# Altium schematic sheet TINY1616.SchDoc
size A4; SheetNumber: 1; SheetTotal: 1
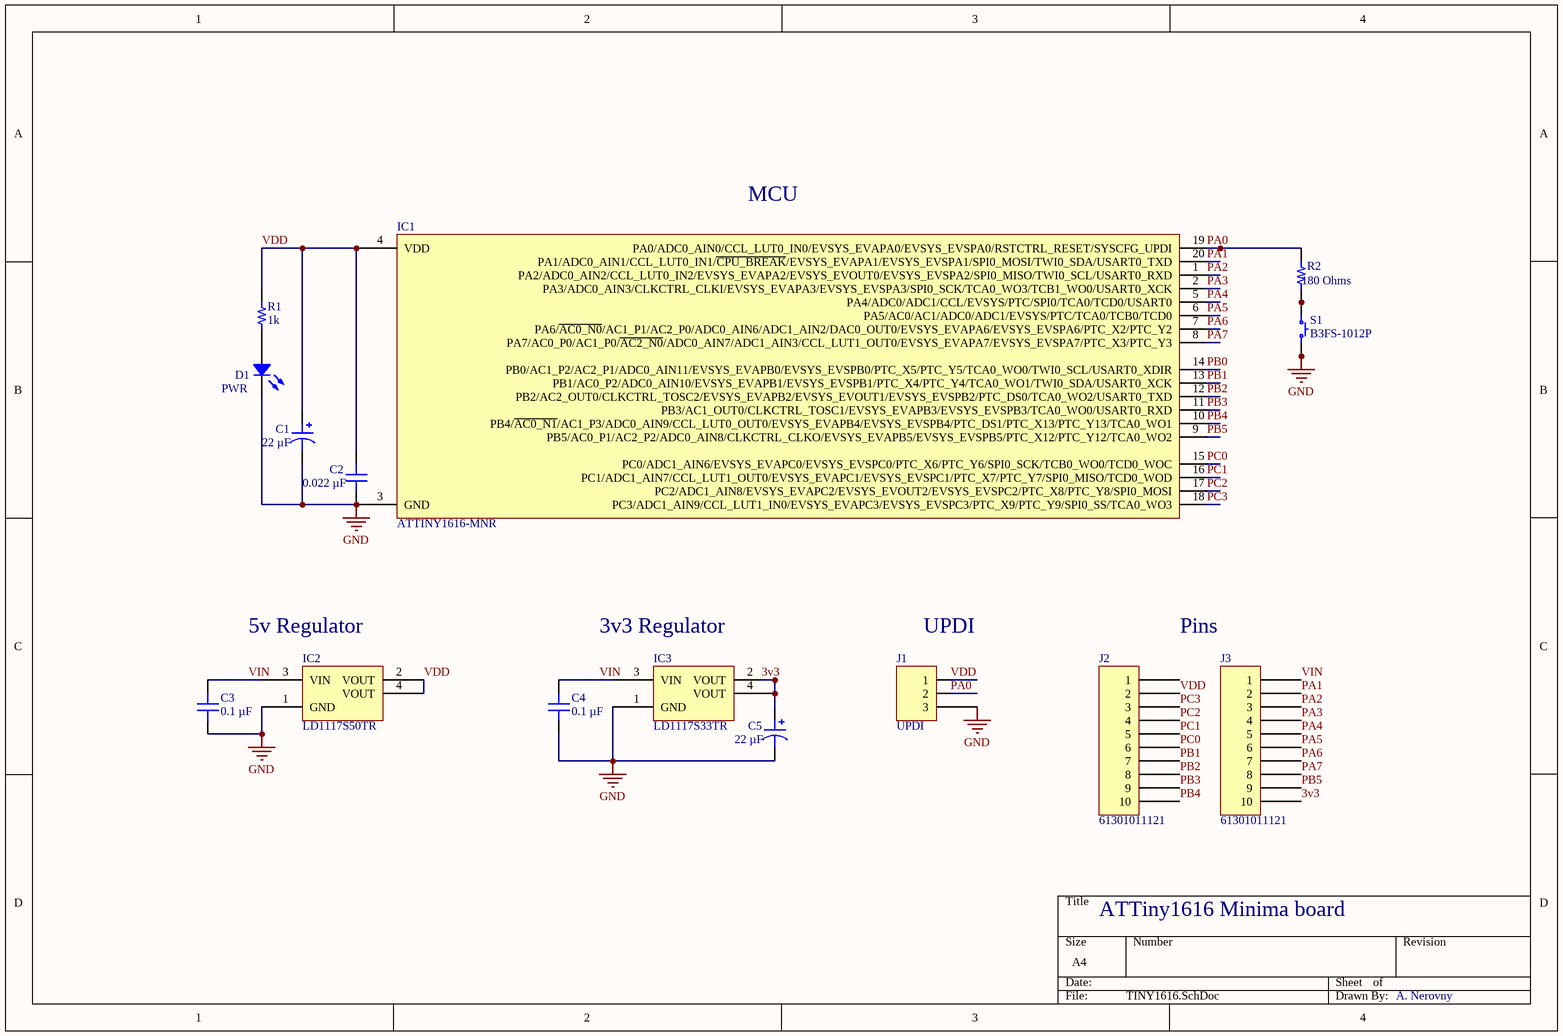
[diagram p0: TINY1616.SchDoc]

## Parts
C1  22 µF  [CAP POL 1206_3216]
C2  0.022 µF  [CAP 0402_1005]
C3  0.1 µF  [CAP 0603_1608]
C4  0.1 µF  [CAP 0603_1608]
C5  22 µF  [CAP POL 1206_3216]
D1  PWR  [LED 0805_2012 GREEN]
IC1  ATTINY1616-MNR  [MICROCHIP VQFN-20 3X3 REB]
IC2  LD1117S50TR  [ST SOT-223]
IC3  LD1117S33TR  [ST SOT-223]
J1  UPDI  [WURTH WE-PHD 61300311121]
J2  61301011121  [WURTH WE-PHD 61301011121]
J3  61301011121  [WURTH WE-PHD 61301011121]
R1  1k  [RES 0402_1005]
R2  180 Ohms  [RES 0603_1608]
S1  B3FS-1012P  [OMRON B3FS-1012P]

## Nets
GND: C1.2 C2.1 C3.1 C4.1 C5.2 D1.2 IC1.3(GND) IC2.1(GND) IC3.1(GND) J1.3 S1.3 S1.4
3v3: C5.1 IC3.2(VOUT) IC3.4(VOUT) J3.10
PA0: IC1.19(PA0/ADC0_AIN0/CCL_LUT0_IN0/EVSYS_EVAPA0/EVSYS_EVSPA0/RSTCTRL_RESET/SYSCFG_UPDI) J1.2 R2.2
PA1: IC1.20(PA1/ADC0_AIN1/CCL_LUT0_IN1/~{CPU_BREAK}/EVSYS_EVAPA1/EVSYS_EVSPA1/SPI0_MOSI/TWI0_SDA/USART0_TXD) J3.2
PA2: IC1.1(PA2/ADC0_AIN2/CCL_LUT0_IN2/EVSYS_EVAPA2/EVSYS_EVOUT0/EVSYS_EVSPA2/SPI0_MISO/TWI0_SCL/USART0_RXD) J3.3
PA3: IC1.2(PA3/ADC0_AIN3/CLKCTRL_CLKI/EVSYS_EVAPA3/EVSYS_EVSPA3/SPI0_SCK/TCA0_WO3/TCB1_WO0/USART0_XCK) J3.4
PA4: IC1.5(PA4/ADC0/ADC1/CCL/EVSYS/PTC/SPI0/TCA0/TCD0/USART0) J3.5
PA5: IC1.6(PA5/AC0/AC1/ADC0/ADC1/EVSYS/PTC/TCA0/TCB0/TCD0) J3.6
PA6: IC1.7(PA6/~{AC0_N0}/AC1_P1/AC2_P0/ADC0_AIN6/ADC1_AIN2/DAC0_OUT0/EVSYS_EVAPA6/EVSYS_EVSPA6/PTC_X2/PTC_Y2) J3.7
PA7: IC1.8(PA7/AC0_P0/AC1_P0/~{AC2_N0}/ADC0_AIN7/ADC1_AIN3/CCL_LUT1_OUT0/EVSYS_EVAPA7/EVSYS_EVSPA7/PTC_X3/PTC_Y3) J3.8
PB0: IC1.14(PB0/AC1_P2/AC2_P1/ADC0_AIN11/EVSYS_EVAPB0/EVSYS_EVSPB0/PTC_X5/PTC_Y5/TCA0_WO0/TWI0_SCL/USART0_XDIR)
PB1: IC1.13(PB1/AC0_P2/ADC0_AIN10/EVSYS_EVAPB1/EVSYS_EVSPB1/PTC_X4/PTC_Y4/TCA0_WO1/TWI0_SDA/USART0_XCK) J2.7
PB2: IC1.12(PB2/AC2_OUT0/CLKCTRL_TOSC2/EVSYS_EVAPB2/EVSYS_EVOUT1/EVSYS_EVSPB2/PTC_DS0/TCA0_WO2/USART0_TXD) J2.8
PB3: IC1.11(PB3/AC1_OUT0/CLKCTRL_TOSC1/EVSYS_EVAPB3/EVSYS_EVSPB3/TCA0_WO0/USART0_RXD) J2.9
PB4: IC1.10(PB4/~{AC0_N1}/AC1_P3/ADC0_AIN9/CCL_LUT0_OUT0/EVSYS_EVAPB4/EVSYS_EVSPB4/PTC_DS1/PTC_X13/PTC_Y13/TCA0_WO1) J2.10
PB5: IC1.9(PB5/AC0_P1/AC2_P2/ADC0_AIN8/CLKCTRL_CLKO/EVSYS_EVAPB5/EVSYS_EVSPB5/PTC_X12/PTC_Y12/TCA0_WO2) J3.9
PC0: IC1.15(PC0/ADC1_AIN6/EVSYS_EVAPC0/EVSYS_EVSPC0/PTC_X6/PTC_Y6/SPI0_SCK/TCB0_WO0/TCD0_WOC) J2.6
PC1: IC1.16(PC1/ADC1_AIN7/CCL_LUT1_OUT0/EVSYS_EVAPC1/EVSYS_EVSPC1/PTC_X7/PTC_Y7/SPI0_MISO/TCD0_WOD) J2.5
PC2: IC1.17(PC2/ADC1_AIN8/EVSYS_EVAPC2/EVSYS_EVOUT2/EVSYS_EVSPC2/PTC_X8/PTC_Y8/SPI0_MOSI) J2.4
PC3: IC1.18(PC3/ADC1_AIN9/CCL_LUT1_IN0/EVSYS_EVAPC3/EVSYS_EVSPC3/PTC_X9/PTC_Y9/SPI0_SS/TCA0_WO3) J2.3
VDD: C1.1 C2.2 IC1.4(VDD) IC2.2(VOUT) IC2.4(VOUT) J1.1 J2.2 R1.2
VIN: C3.2 C4.2 IC2.3(VIN) IC3.3(VIN) J3.1
NetD1_1: D1.1 R1.1
NetR2_1: R2.1 S1.1 S1.2

Not connected (* = marked no-connect by the designer): J2 1

## Notes on the sheet
- (near IC1) MCU
- (near IC2) 5v Regulator
- (near IC3) 3v3 Regulator
- (near J1) UPDI
- Pins
- ATTiny1616 Minima board
- A. Nerovny

## Library data of the parts
C1 C5 = 293D105X9016A8T: manufacturer: Vishay Sprague; Manufacturer Size Code: A; Capacitance: 1 µF; ESR (Equivalent Series Resistance): 9.3Ohm @ 100kHz; Tolerance: ±10%; Type: Molded; Voltage - Rated: 16 V; Part Number: 293D105X9016A8T; Value: 22 µF; componentlink1description: Datasheet; componentlink1url: https://www.vishay.com/docs/40002/293d.pdf; componentlink2description: DigiKey Link; componentlink2url: https://www.digikey.com/en/products/detail/vishay-sprague/293D105X9016A8T/21707485; Device Package: 1206 (3216 Metric); Features: General Purpose; Height - Seated (Max): 0.071" (1.80mm); lastupdated: 03.06.2024 19:29:26; Lifecycle Status: Active; Minimum Order: 1; Mounting Type: Surface Mount; Operating Temperature: -55°C ~ 125°C; Package / Case: 1206 (3216 Metric); packaging: TapeAndReel; partid: 5870; price: 0.18; series: TANTAMOUNT™, 293D; Size / Dimension: 0.126" L x 0.063" W (3.20mm x 1.60mm); Supplier 1: DigiKey; Supplier Part Number 1: 718-293D105X9016A8TCT-ND
C2 = C0402C223K5RECAUTO: CAP CER 0402 22NF 50V X7R 10%; manufacturer: KEMET; Part Number: C0402C223K5RECAUTO; Capacitance: 0.022 µF; Applications: Automotive, ESD Protection; componentlink1description: Datasheet; componentlink1url: https://api.kemet.com/component-edge/download/datasheet/C0402C223K5RECAUTO.pdf; componentlink2description: DigiKey Link; componentlink2url: https://www.digikey.com/en/products/detail/kemet/C0402C223K5RECAUTO/8563694; Device Package: 0402 (1005 Metric); lastupdated: 09.02.2024 20:04:38; Lifecycle Status: Active; Minimum Order: 1; Mounting Type: Surface Mount, MLCC; Operating Temperature: -55°C ~ 125°C; Package / Case: 0402 (1005 Metric); packaging: TapeAndReel; partid: 1729; Part Status: Active; price: 0.01; Ratings: AEC-Q200; series: ESD SMD Auto X7R; Size / Dimension: 0.039" L x 0.020" W (1.00mm x 0.50mm); Supplier 1: DigiKey; Supplier Part Number 1: 399-17166-1-ND; Temperature Coefficient: X7R; Thickness (Max): 0.022" (0.55mm); Tolerance: ±10%; value: 0.022 µF; Voltage - Rated: 50V
C3 C4 = C0603C104K5RAC7411: CAP CER 0.1UF 50V X7R 0603; manufacturer: KEMET; Tolerance: ±10%; Part Number: C0603C104K5RAC7411; Capacitance: 0.1 µF; Applications: Bypass, Decoupling; componentlink1description: Datasheet; componentlink1url: https://api.kemet.com/component-edge/download/datasheet/C0603C104K5RAC7411.pdf; componentlink2description: DigiKey Link; componentlink2url: https://www.digikey.com/en/products/detail/kemet/C0603C104K5RAC7411/3317013; Device Package: 0603 (1608 Metric); lastupdated: 09.02.2024 20:10:30; Lifecycle Status: Active; Minimum Order: 1; Mounting Type: Surface Mount, MLCC; Operating Temperature: -55°C ~ 125°C; Package / Case: 0603 (1608 Metric); packaging: TapeAndReel; partid: 2233; Part Status: Active; price: 0.01; series: SMD Comm X7R; Size / Dimension: 0.063" L x 0.031" W (1.60mm x 0.80mm); Supplier 1: DigiKey; Supplier Part Number 1: 399-C0603C104K5RAC7411CT-ND; Temperature Coefficient: X7R; Thickness (Max): 0.035" (0.90mm); value: 0.1 µF; Voltage - Rated: 50V
D1 = QTLP630C4TR: LED GREEN CLEAR 0805 SMD; Manufacturer: Everlight Electronics Co Ltd; Configuration: Standard; Current - Test: 20mA; Lens Color: Colorless; Lens Size: 1.40mm x 1.25mm; Lens Style: Rectangle with Flat Top; Millicandela Rating: 10mcd; Viewing Angle: 140°; Voltage - Forward (Vf) (Typ): 2.1V; Wavelength - Dominant: 570nm; Wavelength - Peak: 565nm; Part Number: QTLP630C4TR; Color: Green; ComponentLink1Description: Datasheet; ComponentLink1URL: //media.digikey.com/PDF/Data%20Sheets/Everlight%20PDFs/QTLP630-2.pdf; ComponentLink2Description: DigiKey Link; ComponentLink2URL: https://www.digikey.com/en/products/detail/everlight-electronics-co-ltd/QTLP630C4TR/2675902; Device Package: 0805 (2012 Metric); Height (Max): 1.20mm; LastUpdated: 03.06.2024 20:00:30; Lens Transparency: Clear; Lifecycle Status: Active; Minimum Order: 1; Mounting Type: Surface Mount; Package / Case: 0805 (2012 Metric); Packaging: TapeAndReel; PartId: 240; Part Status: Active; Price: 0.05; Series: -; Size / Dimension: 2.00mm L x 1.25mm W; Supplier 1: DigiKey; Supplier Part Number 1: 1080-1411-1-ND; Supplier Device Package: 0805; Value: Green
IC1 = ATTINY1616-MNR: IC MCU 8BIT 16KB FLASH 20VQFN; Manufacturer: Microchip Technology; Connectivity: I²C, IrDA, LINbus, SPI, UART/USART; Core Processor: AVR; Core Size: 8-Bit; Data Converters: A/D 20x10b; D/A 3x8b; EEPROM Size: 256 x 8; Number of I/O: 18; Oscillator Type: Internal; Peripherals: Brown-out Detect/Reset, POR, PWM, WDT; Program Memory Size: 16KB (16K x 8); RAM Size: 2K x 8; Speed: 20MHz; Voltage - Supply (Vcc/Vdd): 1.8V ~ 5.5V; Part Number: ATTINY1616-MNR; ComponentLink1Description: Datasheet; ComponentLink1URL: http://www.microchip.com/mymicrochip/filehandler.aspx?ddocname=en606269; ComponentLink2Description: DigiKey Link; ComponentLink2URL: https://www.digikey.com/en/products/detail/microchip-technology/ATTINY1616-MNR/7354618; LastUpdated: 30.10.2023 22:45:22; Lifecycle Status: Active; Minimum Order: 1; Mounting Type: Surface Mount; Operating Temperature: -40°C ~ 105°C (TA); Package / Case: 20-VFQFN Exposed Pad; Packaging: TapeAndReel; PartId: 283; Part Status: Active; Price: 0.79; Program Memory Type: FLASH; Series: tinyAVR™ 1, Functional Safety (FuSa); Supplier 1: DigiKey; Supplier Part Number 1: ATTINY1616-MNRCT-ND; Supplier Device Package: 20-VQFN (3x3)
IC2 = LD1117S50TR: IC REG LINEAR 5V 800MA SOT223; Manufacturer: STMicroelectronics; Current - Quiescent (Iq): 10 mA; Number of Regulators: 1; Output Configuration: Positive; Output Type: Fixed; Protection Features: Over Current, Over Temperature; PSRR: 75dB (120Hz); Voltage Dropout (Max): 1.2V @ 800mA; Voltage - Input (Max): 15V; Part Number: LD1117S50TR; ComponentLink1Description: Datasheet; ComponentLink1URL: http://www.st.com/content/ccc/resource/technical/document/datasheet/99/3b/7d/91/91/51/4b/be/CD00000544.pdf/files/CD00000544.pdf/jcr:content/translations/en.CD00000544.pdf; ComponentLink2Description: DigiKey Link; ComponentLink2URL: https://www.digikey.com/en/products/detail/stmicroelectronics/LD1117S50TR/1038360; Current - Output: 800mA; LastUpdated: 03.06.2024 20:14:20; Lifecycle Status: Active; Minimum Order: 1; Mounting Type: Surface Mount; Operating Temperature: 0°C ~ 125°C; Package / Case: TO-261-4, TO-261AA; Packaging: TapeAndReel; Part Status: Active; Price: 0.13; Series: -; Supplier 1: DigiKey; Supplier Part Number 1: 497-6447-1-ND; Supplier Device Package: SOT-223; Voltage - Output (Min/Fixed): 5V
IC3 = LD1117S33TR: IC REG LINEAR 3.3V 800MA SOT223; Manufacturer: STMicroelectronics; Current - Quiescent (Iq): 10 mA; Number of Regulators: 1; Output Configuration: Positive; Output Type: Fixed; Protection Features: Over Current, Over Temperature; PSRR: 75dB (120Hz); Voltage Dropout (Max): 1.2V @ 800mA; Voltage - Input (Max): 15V; Part Number: LD1117S33TR; ComponentLink1Description: Datasheet; ComponentLink1URL: http://www.st.com/content/ccc/resource/technical/document/datasheet/99/3b/7d/91/91/51/4b/be/CD00000544.pdf/files/CD00000544.pdf/jcr:content/translations/en.CD00000544.pdf; ComponentLink2Description: DigiKey Link; ComponentLink2URL: https://www.digikey.com/en/products/detail/stmicroelectronics/LD1117S33TR/585766; Current - Output: 800mA; LastUpdated: 03.06.2024 20:14:20; Lifecycle Status: Active; Minimum Order: 1; Mounting Type: Surface Mount; Operating Temperature: 0°C ~ 125°C; Package / Case: TO-261-4, TO-261AA; Packaging: TapeAndReel; Part Status: Active; Price: 0.13; Series: -; Supplier 1: DigiKey; Supplier Part Number 1: 497-1242-1-ND; Supplier Device Package: SOT-223; Voltage - Output (Min/Fixed): 3.3V
J1 = 61300311121: CONN HEADER VERT 3POS 2.54MM; Manufacturer: Würth Elektronik; Contact Length - Mating: 0.236" (6.00mm); Contact Length - Post: 0.118" (3.00mm); Current Rating (Amps): 3A; Material Flammability Rating: UL94 V-0; Number of Positions: 3; Number of Positions Loaded: All; Overall Contact Length: 0.454" (11.54mm); Pitch - Mating: 0.100" (2.54mm); Row Spacing - Mating: -40°C ~ 105°C; Shrouding: Unshrouded; Style: Board to Board or Cable; Part Number: 61300311121; ComponentLink1Description: Datasheet; ComponentLink1URL: https://katalog.we-online.de/em/datasheet/6130xx11121.pdf; ComponentLink2Description: DigiKey Link; ComponentLink2URL: https://www.digikey.com/en/products/detail/würth-elektronik/61300311121/4846825; Connector Type: Header; Contact Finish - Mating: Gold; Contact Material: Copper Alloy; Contact Shape: Square; Contact Type: Male Pin; Fastening Type: Push-Pull; Insulation Color: Black; Insulation Height: 0.100" (2.54mm); Insulation Material: Polyamide (PA6T), Nylon 6T; LastUpdated: 18.10.2024 13:43:15; Lifecycle Status: Active; Minimum Order: 1; Mounting Type: Through Hole; Number of Rows: 1; Operating Temperature: -40°C ~ 105°C; Packaging: Bulk; PartId: 189; Part Status: Active; Price: 0.07; Series: WR-PHD; Supplier 1: DigiKey; Supplier Part Number 1: 732-5316-ND; Termination: Solder
J2 J3 = 61301011121: CONN HEADER VERT 10POS 2.54MM; Manufacturer: Würth Elektronik; Contact Length - Mating: 0.236" (6.00mm); Contact Length - Post: 0.118" (3.00mm); Current Rating (Amps): 3A; Material Flammability Rating: UL94 V-0; Number of Positions: 10; Number of Positions Loaded: All; Overall Contact Length: 0.454" (11.54mm); Pitch - Mating: 0.100" (2.54mm); Row Spacing - Mating: -40°C ~ 105°C; Shrouding: Unshrouded; Style: Board to Board or Cable; Part Number: 61301011121; ComponentLink1Description: Datasheet; ComponentLink1URL: https://katalog.we-online.de/em/datasheet/6130xx11121.pdf; ComponentLink2Description: DigiKey Link; ComponentLink2URL: https://www.digikey.com/en/products/detail/würth-elektronik/61301011121/2508439; Connector Type: Header; Contact Finish - Mating: Gold; Contact Material: Copper Alloy; Contact Shape: Square; Contact Type: Male Pin; Fastening Type: Push-Pull; Insulation Color: Black; Insulation Height: 0.100" (2.54mm); Insulation Material: Polyamide (PA6T), Nylon 6T; LastUpdated: 18.10.2024 13:42:05; Lifecycle Status: Active; Minimum Order: 1; Mounting Type: Through Hole; Number of Rows: 1; Operating Temperature: -40°C ~ 105°C; Packaging: Bulk; PartId: 188; Part Status: Active; Price: 0.70; Series: WR-PHD; Supplier 1: DigiKey; Supplier Part Number 1: 732-2670-ND; Termination: Solder
R1 = RCA04021K00FKEDHP: RES 1K OHM 1% 1/5W 0402; Manufacturer: Vishay Dale; Power (Watts): 0.2W, 1/5W; Resistance: 1 kOhms; Temperature Coefficient: ±100ppm/°C; Part Number: RCA04021K00FKEDHP; Value: 1k; ComponentLink1Description: Datasheet; ComponentLink1URL: http://www.vishay.com/docs/20067/rcahp.pdf; ComponentLink2Description: DigiKey Link; ComponentLink2URL: https://www.digikey.com/en/products/detail/vishay-dale/RCA04021K00FKEDHP/6561237; Composition: Thick Film; Device Package: 0402 (1005 Metric); Features: Anti-Sulfur, Automotive AEC-Q200, Pulse Withstanding; Height - Seated (Max): 0.016" (0.40mm); LastUpdated: 09.02.2024 20:30:21; Lifecycle Status: Active; Minimum Order: 1; Number of Terminations: 2; Operating Temperature: -55°C ~ 155°C; Package / Case: 0402 (1005 Metric); Packaging: TapeAndReel; PartId: 3119; Part Status: Active; Price: 0.02; Ratings: AEC-Q200; Series: RCA-HP; Size / Dimension: 0.039" L x 0.020" W (1.00mm x 0.50mm); Supplier 1: DigiKey; Supplier Part Number 1: 541-3240-1-ND; Supplier Device Package: 0402; Tolerance: ±1%
R2 = CRCW0603180RJNEA: RES SMD 180 OHM 5% 1/10W 0603; Manufacturer: Vishay Dale; Power (Watts): 0.1W, 1/10W; Temperature Coefficient: ±200ppm/°C; Part Number: CRCW0603180RJNEA; Value: 180 Ohms; ComponentLink1Description: Datasheet; ComponentLink1URL: http://www.vishay.com/docs/20035/dcrcwe3.pdf; ComponentLink2Description: DigiKey Link; ComponentLink2URL: https://www.digikey.com/en/products/detail/vishay-dale/CRCW0603180RJNEA/1174211; Composition: Thick Film; Device Package: 0603 (1608 Metric); Features: Automotive AEC-Q200; Height - Seated (Max): 0.020" (0.50mm); LastUpdated: 09.02.2024 20:43:36; Lifecycle Status: Active; Minimum Order: 1; Number of Terminations: 2; Operating Temperature: -55°C ~ 155°C; Package / Case: 0603 (1608 Metric); Packaging: TapeAndReel; PartId: 5152; Part Status: Active; Price: 0.01; Ratings: AEC-Q200; Resistance: 180 Ohms; Series: CRCW; Size / Dimension: 0.063" L x 0.033" W (1.60mm x 0.85mm); Supplier 1: DigiKey; Supplier Part Number 1: 541-180GCT-ND; Supplier Device Package: 0603; Tolerance: ±5%
S1 = B3FS-1012P: SWITCH TACTILE SPST-NO 0.05A 24V; Manufacturer: Omron Electronics Inc-EMC Div; Actuator Height off PCB, Vertical: 4.30mm; Actuator Orientation: Top Actuated; Actuator Type: Standard; Contact Rating @ Voltage: 0.05A @ 24VDC; Illumination: Non-Illuminated; Operating Force: 150gf; Outline: 6.30mm x 6.00mm; Switch Function: Off-Mom; Part Number: B3FS-1012P; Circuit: SPST-NO; ComponentLink1Description: Datasheet; ComponentLink1URL: https://omronfs.omron.com/en_US/ecb/products/pdf/en-b3fs.pdf; ComponentLink2Description: DigiKey Link; ComponentLink2URL: http://digikey.com/product-detail/en/omron-electronics-inc-emc-div/B3FS-1012P/SW1237CT-ND/2747253; LastUpdated: 30.03.2020 15:12:46; Lifecycle Status: Active; Minimum Order: 1; Mounting Type: Surface Mount; Operating Temperature: -25°C ~ 70°C; Packaging: TapeAndReel; Part Status: Active; Price: 0.35; Series: B3FS; Supplier 1: DigiKey; Supplier Part Number 1: SW1237CT-ND; Termination Style: Gull Wing